# Altium schematic sheet AUDIO.SchDoc: Audio Codec WOLFSON and Audio Connectors
size A4; Date: 29-OCT-2015; Author: A.B; CompanyName: STMicroelectronics; Organization: MCD/TOOLS/GNB; Address1: 12, Rue Jules HOROWITZ; Address2: 38019 Grenoble; Address3: FRANCE; DocumentNumber: MB1225; Revision: B-01; SheetNumber: 5; SheetTotal: 13; Project: STM32F769I-DISCO
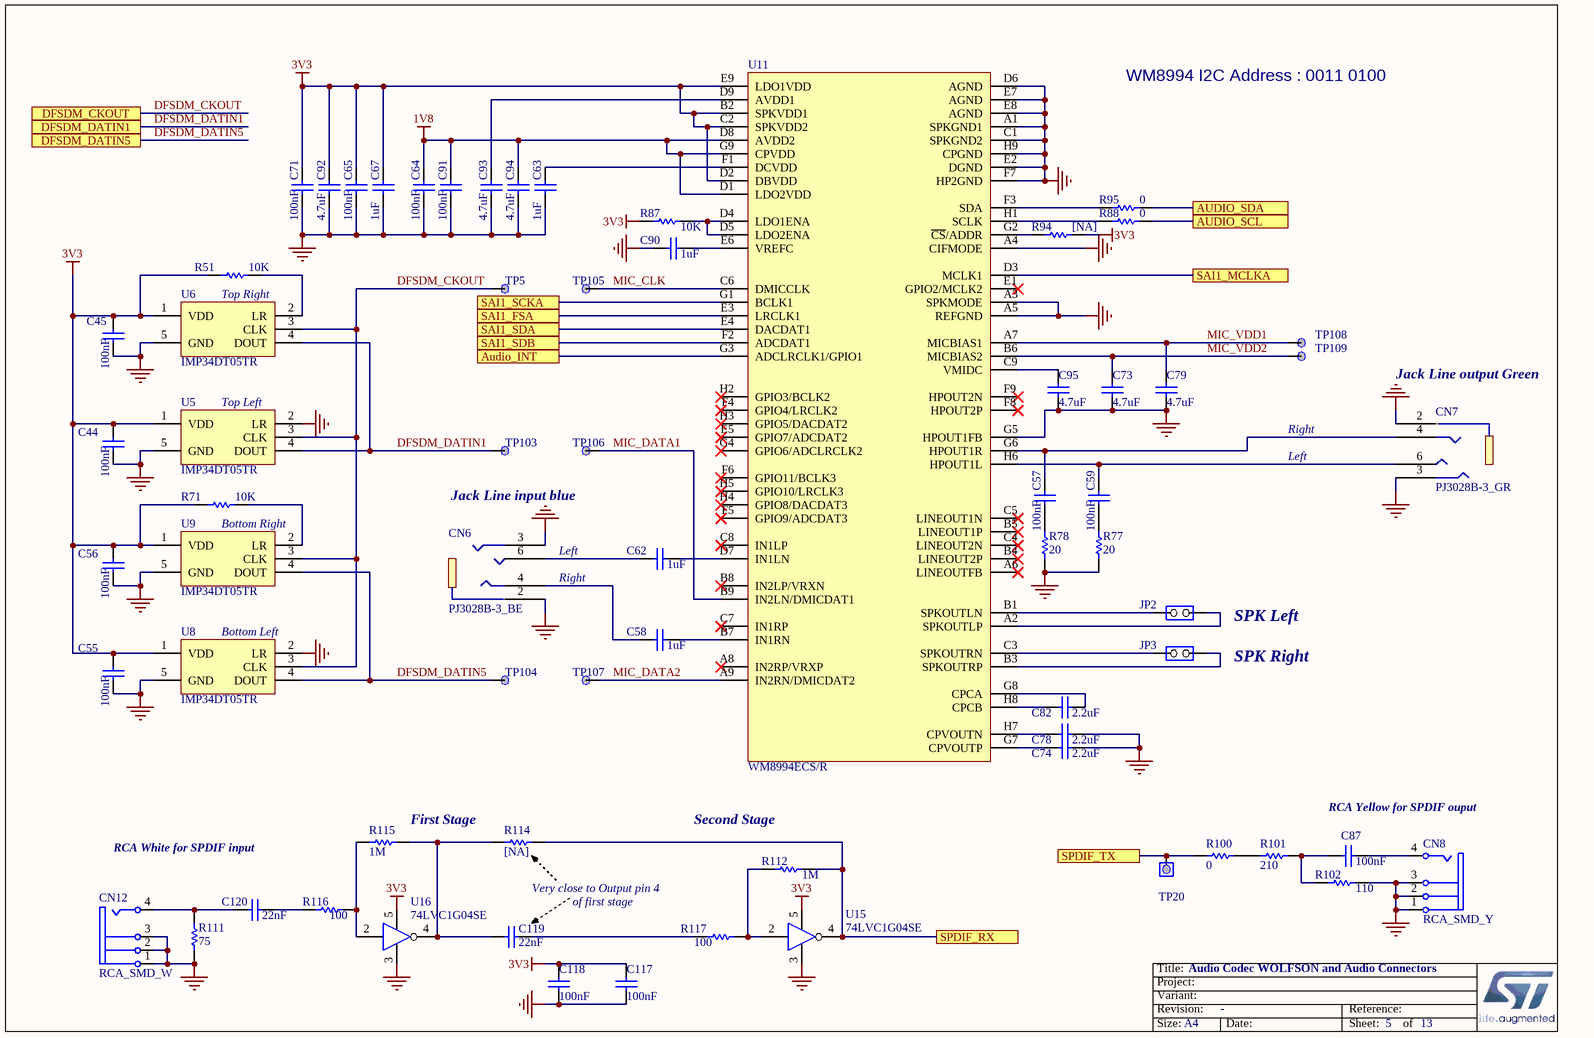
[diagram p0: AUDIO.SchDoc]

## Parts
C44  100nF  [0402C]
C45  100nF  [0402C]
C55  100nF  [0402C]
C56  100nF  [0402C]
C57  100nF  [0402C]
C58  1uF  [0603C]
C59  100nF  [0402C]
C62  1uF  [0603C]
C63  1uF  [0603C]
C64  100nF  [0402C]
C65  100nF  [0402C]
C67  1uF  [0603C]
C71  100nF  [0402C]
C73  4.7uF  [0603C]
C74  2.2uF  [0603C]
C78  2.2uF  [0603C]
C79  4.7uF  [0603C]
C82  2.2uF  [0603C]
C87  100nF  [0402C]
C90  1uF  [0603C]
C91  100nF  [0402C]
C92  4.7uF  [0603C]
C93  4.7uF  [0603C]
C94  4.7uF  [0603C]
C95  4.7uF  [0603C]
C117  100nF  [0402C]
C118  100nF  [0402C]
C119  22nF  [0402C]
C120  22nF  [0402C]
CN6  PJ3028B-3_BE  [PJ3028B]
CN7  PJ3028B-3_GR  [PJ3028B]
CN8  RCA_SMD_Y  [PHONE_JACK_JBB0819100002]
CN12  RCA_SMD_W  [PHONE_JACK_JBB0819100002]
JP2  JP2  [SIP2]  (value not drawn)
JP3  JP2  [SIP2]  (value not drawn)
R51  10K  [0402R]
R71  10K  [0402R]
R77  20  [0402R]
R78  20  [0402R]
R87  10K  [0402R]
R88  0  [0402R]
R94  [NA]  [0402R]
R95  0  [0402R]
R100  0  [0402R]
R101  210  [0402R]
R102  110  [0402R]
R111  75  [0402R]
R112  1M  [0402R]
R114  [NA]  [0402R]
R115  1M  [0402R]
R116  100  [0402R]
R117  100  [0402R]
TP5  TP  [TP_C40]  (value not drawn)
TP20  Test point 1 pin with hole  [TP]  (value not drawn)
TP103  TP  [TP_C40]  (value not drawn)
TP104  TP  [TP_C40]  (value not drawn)
TP105  TP  [TP_C40]  (value not drawn)
TP106  TP  [TP_C40]  (value not drawn)
TP107  TP  [TP_C40]  (value not drawn)
TP108  TP  [TP_C40]  (value not drawn)
TP109  TP  [TP_C40]  (value not drawn)
U5  IMP34DT05TR  [MIC_HCLGA_3X4X1_4LD]
U6  IMP34DT05TR  [MIC_HCLGA_3X4X1_4LD]
U8  IMP34DT05TR  [MIC_HCLGA_3X4X1_4LD]
U9  IMP34DT05TR  [MIC_HCLGA_3X4X1_4LD]
U11  WM8994ECS/R  [BGA72_0R5_4R5X4]
U15  74LVC1G04SE  [SOT-353]
U16  74LVC1G04SE  [SOT-353]

## Ports
Audio_INT, AUDIO_SCL, AUDIO_SDA, DFSDM_CKOUT, DFSDM_DATIN1, DFSDM_DATIN5, SAI1_FSA, SAI1_MCLKA, SAI1_SCKA, SAI1_SDA, SAI1_SDB, SPDIF_RX, SPDIF_TX

## Nets
1V8: C64.1 C91.1 C94.1 U11.D1(LDO2VDD) U11.D8(AVDD2) U11.G9(CPVDD)
3V3: C44.1 C45.1 C55.1 C56.1 C65.1 C67.2 C71.1 C92.1 C117.2 C118.2 R51.2 R71.2 R87.2 R94.2 U5.1(VDD) U6.1(VDD) U8.1(VDD) U9.1(VDD) U11.B2(SPKVDD1) U11.C2(SPKVDD2) U11.D2(DBVDD) U11.E9(LDO1VDD) U15.5(VCC) U16.5(VCC)
GND: C44.2 C45.2 C55.2 C56.2 C63.1 C64.2 C65.2 C67.1 C71.2 C73.1 C74.2 C78.2 C79.1 C90.2 C91.2 C92.2 C93.2 C94.2 C95.1 C117.1 C118.1 CN6.2 CN6.3 CN7.2 CN7.3 CN8.1(Ground) CN8.2(Ground) CN8.3(Ground) CN12.1(Ground) CN12.2(Ground) CN12.3(Ground) R77.2 R78.2 R102.2 R111.1 U5.2(LR) U5.5(GND) U6.5(GND) U8.2(LR) U8.5(GND) U9.5(GND) U11.A1(SPKGND1) U11.A3(SPKMODE) U11.A4(CIFMODE) U11.A5(REFGND) U11.C1(SPKGND2) U11.D6(AGND) U11.E2(DGND) U11.E7(AGND) U11.E8(AGND) U11.F7(HP2GND) U11.G5(HPOUT1FB) U11.H9(CPGND) U15.3(GND) U16.3(GND)
Audio_INT: U11.G3(ADCLRCLK1/GPIO1) ; port Audio_INT
AUDIO_SCL: R88.1 ; port AUDIO_SCL
AUDIO_SDA: R95.1 ; port AUDIO_SDA
DFSDM_CKOUT: TP5.1 U5.3(CLK) U6.3(CLK) U8.3(CLK) U9.3(CLK) ; port DFSDM_CKOUT
DFSDM_DATIN1: TP103.1 U5.4(DOUT) U6.4(DOUT) ; port DFSDM_DATIN1
DFSDM_DATIN5: TP104.1 U8.4(DOUT) U9.4(DOUT) ; port DFSDM_DATIN5
MIC_CLK: TP105.1 U11.C6(DMICCLK)
MIC_DATA1: TP106.1 U11.B9(IN2LN/DMICDAT1)
MIC_DATA2: TP107.1 U11.A9(IN2RN/DMICDAT2)
MIC_VDD1: C79.2 TP108.1 U11.A7(MICBIAS1)
MIC_VDD2: C73.2 TP109.1 U11.B6(MICBIAS2)
SAI1_FSA: U11.E3(LRCLK1) ; port SAI1_FSA
SAI1_MCLKA: U11.D3(MCLK1) ; port SAI1_MCLKA
SAI1_SCKA: U11.G1(BCLK1) ; port SAI1_SCKA
SAI1_SDA: U11.E4(DACDAT1) ; port SAI1_SDA
SAI1_SDB: U11.F2(ADCDAT1) ; port SAI1_SDB
SPDIF_RX: R112.2 R114.2 U15.4(Y) ; port SPDIF_RX
SPDIF_TX: R100.1 TP20.1(COMMON) ; port SPDIF_TX
NetC57_1: C57.1 CN7.4 U11.G6(HPOUT1R)
NetC57_2: C57.2 R78.1
NetC58_1: C58.1 U11.B7(IN1RN)
NetC58_2: C58.2 CN6.4
NetC59_1: C59.1 CN7.6 U11.H6(HPOUT1L)
NetC59_2: C59.2 R77.1
NetC62_1: C62.1 U11.D7(IN1LN)
NetC62_2: C62.2 CN6.6
NetC63_2: C63.2 U11.F1(DCVDD)
NetC74_1: C74.1 U11.G7(CPVOUTP)
NetC78_1: C78.1 U11.H7(CPVOUTN)
NetC82_1: C82.1 U11.H8(CPCB)
NetC82_2: C82.2 U11.G8(CPCA)
NetC87_1: C87.1 R101.2 R102.1
NetC87_2: C87.2 CN8.4(Signal)
NetC90_1: C90.1 U11.E6(VREFC)
NetC93_1: C93.1 U11.D9(AVDD1)
NetC95_2: C95.2 U11.C9(VMIDC)
NetC119_1: C119.1 R114.1 R115.2 U16.4(Y)
NetC119_2: C119.2 R117.1
NetC120_1: C120.1 CN12.4(Signal) R111.2
NetC120_2: C120.2 R116.1
NetJP2_1: JP2.1(COMMON) U11.B1(SPKOUTLN)
NetJP2_2: JP2.2(NO) U11.A2(SPKOUTLP)
NetJP3_1: JP3.1(COMMON) U11.C3(SPKOUTRN)
NetJP3_2: JP3.2(NO) U11.B3(SPKOUTRP)
NetR51_1: R51.1 U6.2(LR)
NetR71_1: R71.1 U9.2(LR)
NetR87_1: R87.1 U11.D4(LDO1ENA) U11.D5(LDO2ENA)
NetR88_2: R88.2 U11.H1(SCLK)
NetR94_1: R94.1 U11.G2(~{CS}/ADDR)
NetR95_2: R95.2 U11.F3(SDA)
NetR100_2: R100.2 R101.1
NetR112_1: R112.1 R117.2 U15.2(A)
NetR115_1: R115.1 R116.2 U16.2(A)

Not connected (* = marked no-connect by the designer): U11 A6(LINEOUTFB)* A8(IN2RP/VRXP)* B4(LINEOUT2P)* B5(LINEOUT1P)* B8(IN2LP/VRXN)* C4(LINEOUT2N)* C5(LINEOUT1N)* C7(IN1RP)* C8(IN1LP)* E1(GPIO2/MCLK2)* E5(GPIO7/ADCDAT2)* F4(GPIO4/LRCLK2)* F5(GPIO9/ADCDAT3)* F6(GPIO11/BCLK3)* F8(HPOUT2P)* F9(HPOUT2N)* G4(GPIO6/ADCLRCLK2)* H2(GPIO3/BCLK2)* H3(GPIO5/DACDAT2)* H4(GPIO8/DACDAT3)* H5(GPIO10/LRCLK3)*; U15 1(NC); U16 1(NC)

## Notes on the sheet
- WM8994 I2C Address : 0011 0100
- Top Right
- (near CN7) Jack Line output Green
- (near U5) Top Left
- Right
- Jack Line input blue
- Left
- Bottom Right
- (near U8) Bottom Left
- SPK Left
- SPK Right
- RCA White for SPDIF input
- First Stage
- Second Stage
- RCA Yellow for SPDIF ouput
- Very close to Output pin 4
- of first stage
- Title:
- Project:
- Size:
- Revision:
- Variant:
- A4
- -
- Date:
- Reference:
- Sheet:
- of

## Library data of the parts
C44 C45 C55-C57 C59 C64 C65 C71 C87 C91 C117 C118 = Cap_100nF_X7R_10%_0402: Capacitor,100nF,16V,X7R,10%,0402,YAGEO; Manuf_Part_1: CC0402KRX7R7BB104; Revision: July-2002: Re-released for DXP Platform.; Value: 100nF; Order: CC0402KRX7R7BB104; Manuf_1: YAGEO
  C44 C45 C55-C57 C59 C64 C65 C71 C91: ECCN_US/EU: n/a
C58 C62 C63 C67 C90 = Cap_1uF_X5R_10%_0603: Capacitor,1uF,16V,X5R,10%,0603,YAGEO; Manuf_Part_1: CC0603KRX5R7BB105; Revision: July-2002: Re-released for DXP Platform.; Value: 1uF; Order: CC0603KRX5R7BB105; Manuf_1: YAGEO; ECCN_US/EU: n/a
C73 C79 C92-C95 = Cap_4.7uF_X5R_10%_0603: Capacitor,4.7uF,16V, X5R,10%,0603,YAGEO; Manuf_Part_1: CC0603KRX5R7BB475; Order: CC0603KRX5R7BB105; Revision: July-2002: Re-released for DXP Platform.; Value: 4.7uF; Manuf_1: YAGEO; ECCN_US/EU: n/a
C74 C78 C82 = Cap_2.2uF_X5R_10%_0603: Capacitor,2.2uF,10V, X5R,10%,0603,YAGEO; Manuf_Part_1: CC0603KRX5R6BB225; Manuf_Part_2: C0603C225K8PACTU; Manuf_2: KEMET; Revision: July-2002: Re-released for DXP Platform.; Value: 2.2uF; Order: *; Manuf_1: YAGEO; ECCN_US/EU: n/a
C119 C120 = Cap_22nF_X7R_10%_0402: Capacitor,22nF,16V,X7R,10%,0402,YAGEO; Manuf_Part_1: CC0402KRX7R7BB223; Revision: July-2002: Re-released for DXP Platform.; Value: 22nF; Order: CC0402KRX7R7BB223; Manuf_1: YAGEO; ECCN_US/EU: n/a
CN6 = PJ3028B-3_BE: Connector Jack Stereo 3.5mm, female SMT, Blue (Line input); Manuf_Part_2: PJ30280-3_BE; ECCN_US/EU: n/a; Manuf_Part_1: PJ3028B-3_BE; Manuf_1: http://ww.qiaod.com
CN7 = PJ3028B-3_GR: Connector Jack Stereo 3.5mm, female SMT, Green (Line output); Manuf_Part_2: PJ30280-3_GR; ECCN_US/EU: n/a; Manuf_Part_1: PJ3028B-3_GR; Manuf_1: http://ww.qiaod.com
CN8 = RCA_SMD_Y: RCA Phono Jack, Right Angle, SMD, Yellow; Manuf_Part_1: JBB0819100002; Manuf_1: JIUBABA; Manuf_2: CUI Inc; Manuf_Part_2: RCJ-014-SMT; Distrib: Sub Co; ECCN_US/EU: n/a
CN12 = RCA_SMD_W: RCA Phono Jack, Right Angle, SMD, White; Manuf_Part_1: JBB0819100004; Manuf_1: JIUBABA; Manuf_2: CUI Inc; Manuf_Part_2: RCJ-013-SMT; Distrib: Sub Co; ECCN_US/EU: n/a
JP2 JP3 = JP2: Fitted: NO; ECCN_US/EU: n/a
R51 R71 R87 = Res_10K_1%_0402: Resistor,10K,0402,1%,YAGEO; Manuf_Part_1: RC0402FR-0710KL; Value: 10K; Manuf_1: YAGEO; Order: RC0402FR-0710KL; ECCN_US/EU: n/a
R77 R78 = Res_20_1%_0402: Resistor,20,0402,1%,YAGEO; Manuf_Part_1: RC0402FR-0720RL; Value: 20; Manuf_1: YAGEO; Order: *; ECCN_US/EU: n/a
R88 R95 R100 = Res_0_5%_0402: Resistor,0,0402,5%,YAGEO; Manuf_Part_1: RC0402JR-070RL; Order: 2363467; Value: 0; ECCN_US/EU: n/a; Manuf_1: YAGEO; Distrib: FARNELL
R94 R114 = Res_NA_0402: Resistor,[NA],0402; Fitted: NO; Value: [NA]; ECCN_US/EU: n/a
R101 = Res_210_1%_0402: Resistor,210,0402,1%,YAGEO; Manuf_Part_1: RC0402FR-07210RL; Value: 210; Manuf_1: YAGEO; Order: *; ECCN_US/EU: n/a; Distrib: DIGIKEY
R102 = Res_110_1%_0402: Resistor,110,0402,1%,YAGEO; Manuf_Part_1: RC0402FR-07110RL; Value: 110; Manuf_1: YAGEO; Order: *; ECCN_US/EU: n/a; Distrib: Distrib
R111 = Res_75_1%_0402: Resistor,75,0402,1%,YAGEO; Manuf_Part_1: RC0402FR-0775RL; Order: 311-75.0LRTR-ND; Value: 75; Manuf_1: YAGEO; ECCN_US/EU: n/a; Distrib: DIGIKEY
R112 R115 = Res_1M_1%_0402: Resistor,1M,0402,1%,YAGEO; Manuf_Part_1: RC0402FR-071ML; Value: 1M; Manuf_1: YAGEO; Order: RC0402FR-071ML; ECCN_US/EU: n/a
R116 R117 = Res_100_1%_0402: Resistor,100,0402,1%,YAGEO; Manuf_Part_1: RC0402FR-07100RL; Order: 9239111; Value: 100; Manuf_1: YAGEO; ECCN_US/EU: n/a; Distrib: FARNELL
TP5 TP103-TP109 = TP: Test Point; ECCN_US/EU: n/a
TP20 = TP1: Test Point; Fitted: NO; ECCN_US/EU: n/a
U5 U6 U8 U9 = MCD-01715: MEMS audio sensor omnidirectional digital microphone for industrial applications; BMS_Part_Number: 9177995; Part_Type: IC; Manufacturer: STMICROELECTRONICS; Provided_By: SUBCO with ST control; ECCN_EU: NEC; ECCN_US: EAR99; Internal_Part_Number: MCD-01715; Value: IMP34DT05TR; Status: Released; Manufacturer_Part_Number: IMP34DT05TR; Package: HCLGA-4LD; ComponentLink1Description: Datasheet; ComponentLink1URL: http://tunmcdsvn.tun.st.com/Component_Datasheet_Library/Trunk/IC/STM_Digital-Microphone_IMP34DT05TR
U11 = WM8994ECS/R: Multi-Channel Audio Hub CODEC for Smartphones; Manuf_1: Cirrus Logic; ECCN_US/EU: EAR99/NEC; Manuf_Part_1: WM8994ECS/R; Distrib: Cirrus Logic
U15 U16 = 74LVC1G04SE: Single inverter gate with a standard push-pull output. (1.65V to 5.5V); Manuf_Part_1: 74LVC1G04SE-7; Manuf_1: DIODES; Order: 1845218; ECCN_US/EU: EAR99/NEC; Footprint: SOT353; Distrib: FARNELL